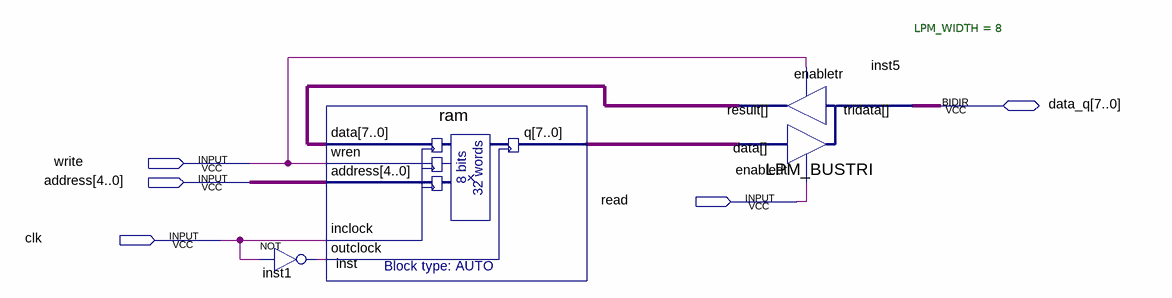
[diagram p0: schematic sheet]
// Quartus schematic ram0.bdf as structural Verilog: 3 symbols, 5 pins
module ram0 (
  input  write,
  input  [4:0] address,
  input  read,
  input  clk,
  inout  [7:0] data_q
);

  wire inst1_out;
  wire [7:0] inst5_result, inst_q;

  not inst1 (inst1_out, clk);
  ram inst (.data(inst5_result), .wren(write), .address(address), .inclock(clk), .outclock(inst1_out), .q(inst_q));
  LPM_BUSTRI #(.LPM_WIDTH(8)) inst5 (
    .data(inst_q), .enabledt(read), .enabletr(write), .result(inst5_result), .tridata(data_q));
endmodule
